# EasyEDA Pro project ProProject_zelda_guardian.epro, schematic main_sch

## Sheets
1 esp32s3: Create Date: 2023-06-17; Page Name: esp32s3; Project Name: zelda_guardian; Schematic Name: main_sch; Update Date: 2023-06-23; Company: 嘉立创EDA; Page Size: A4; Version: V1.0
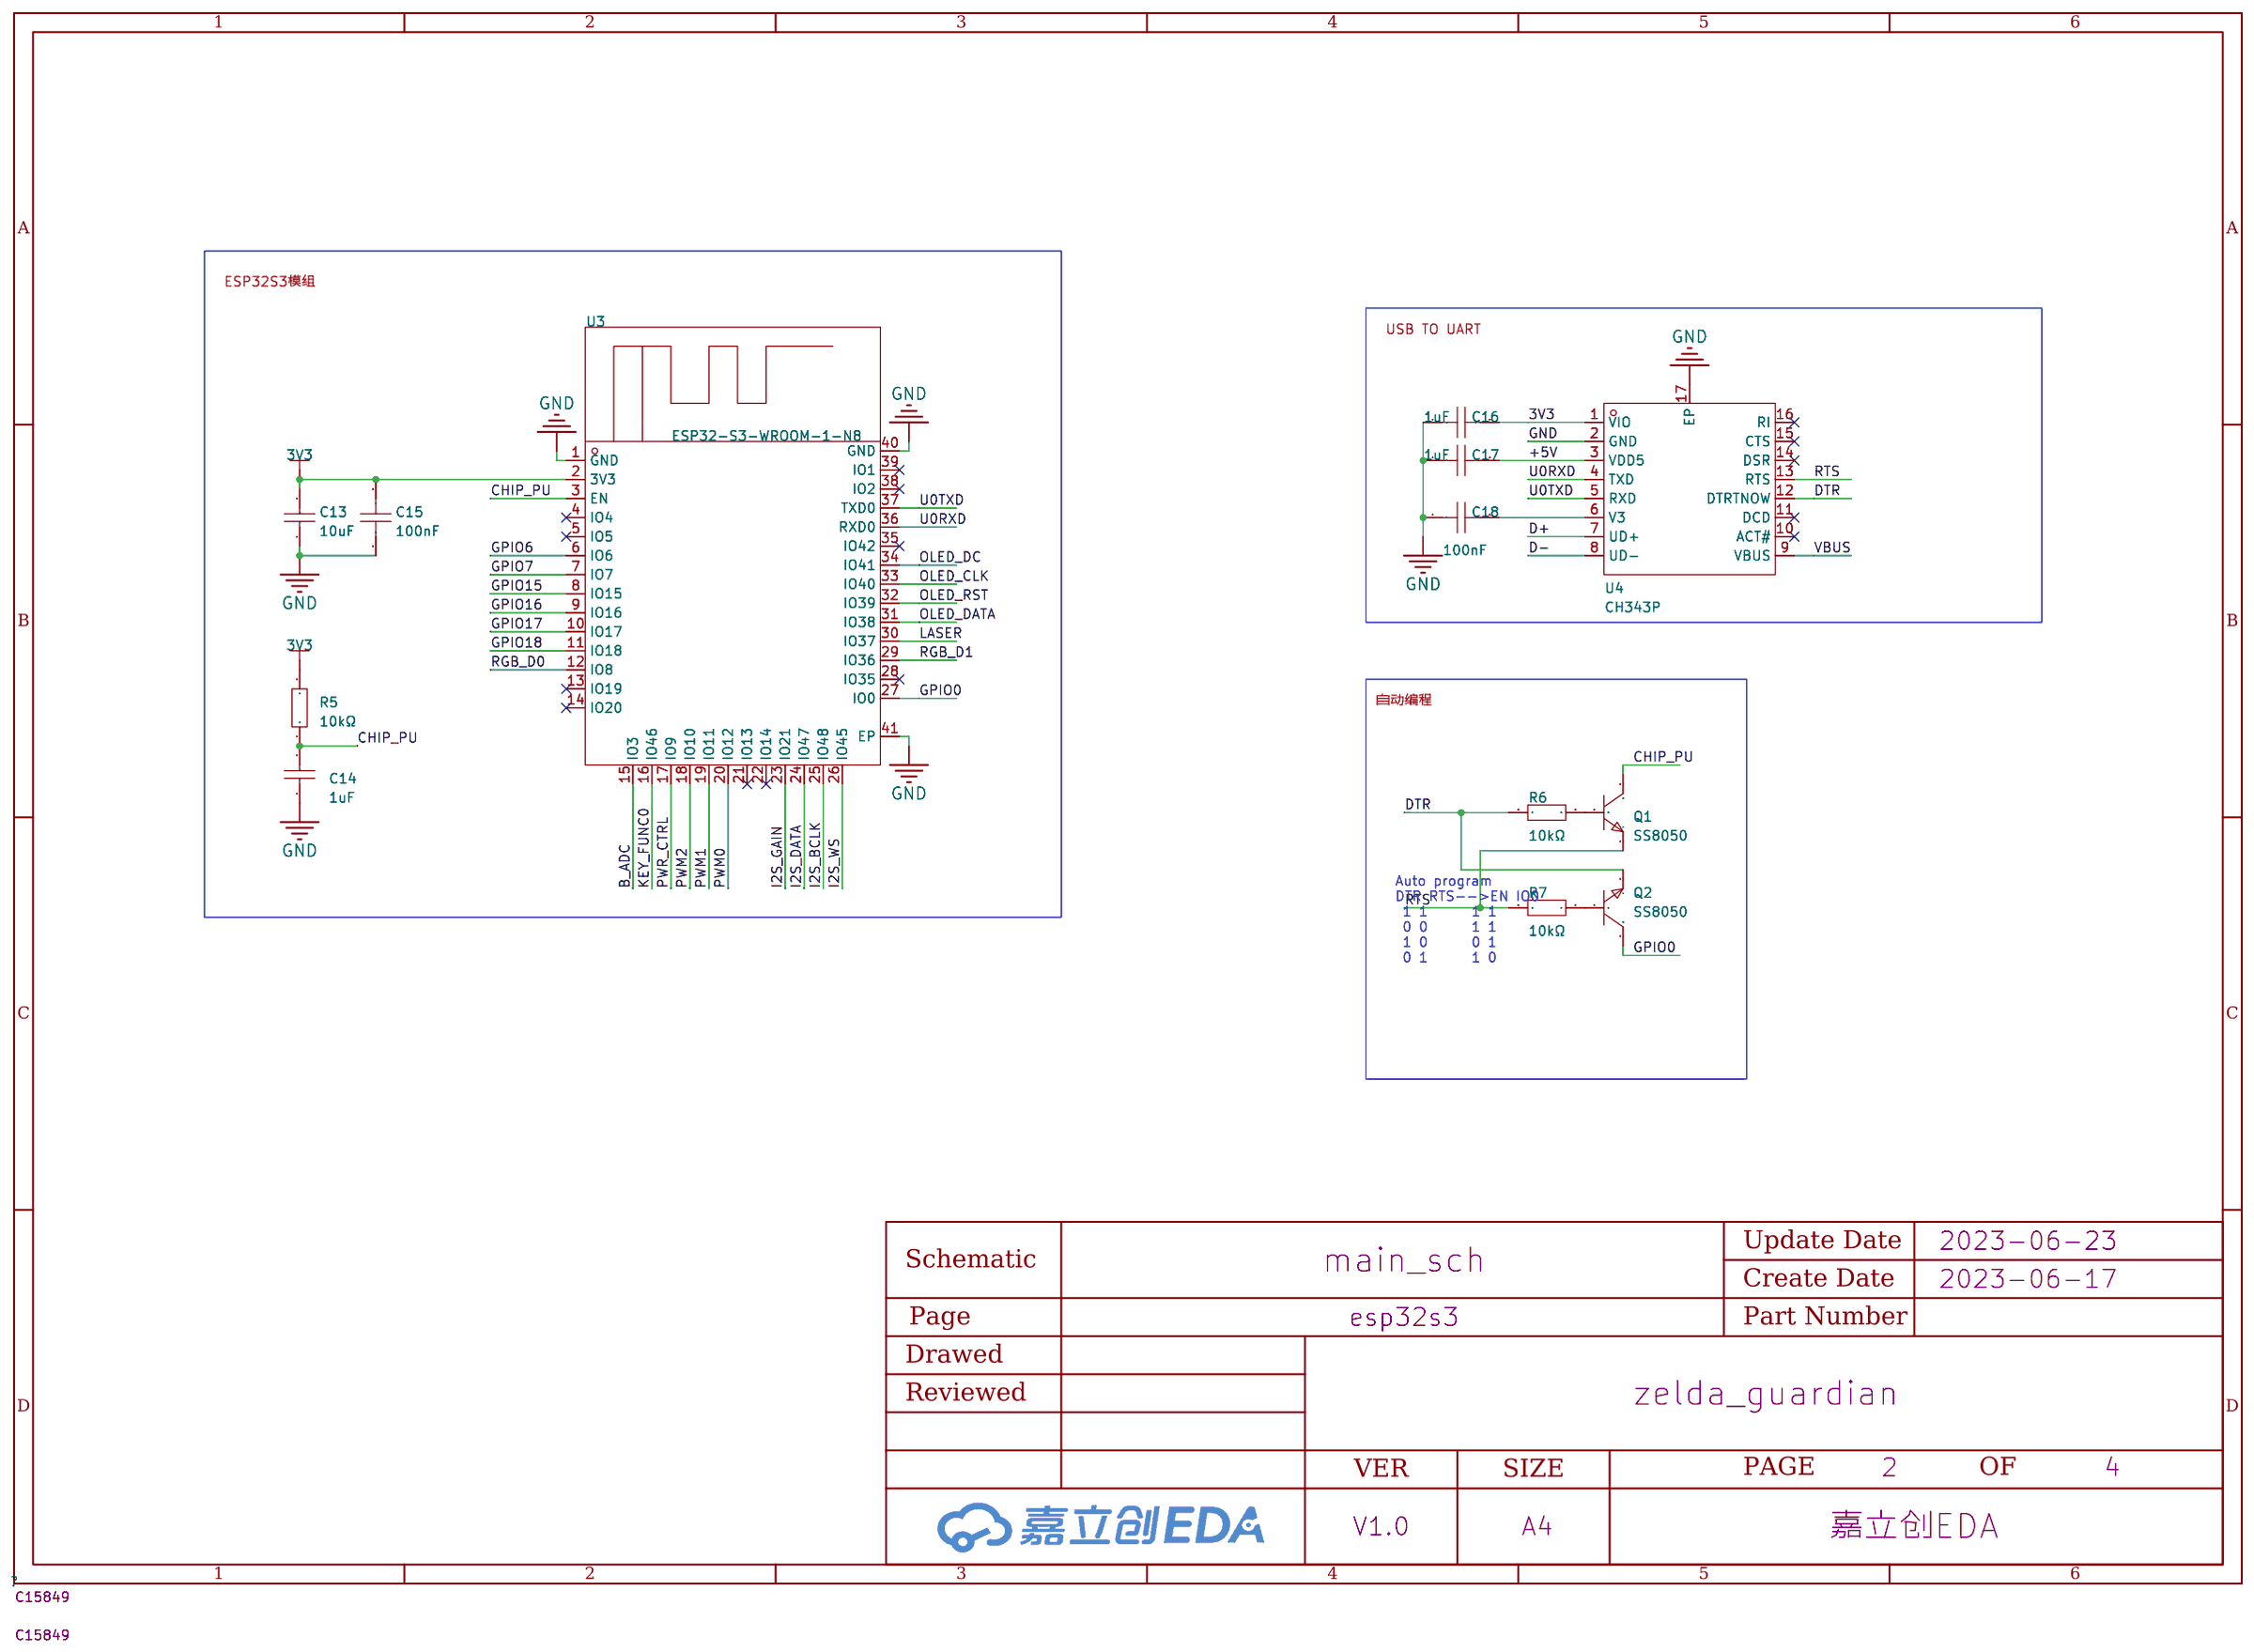
[diagram p0: esp32s3]
2 power: Page Name: power
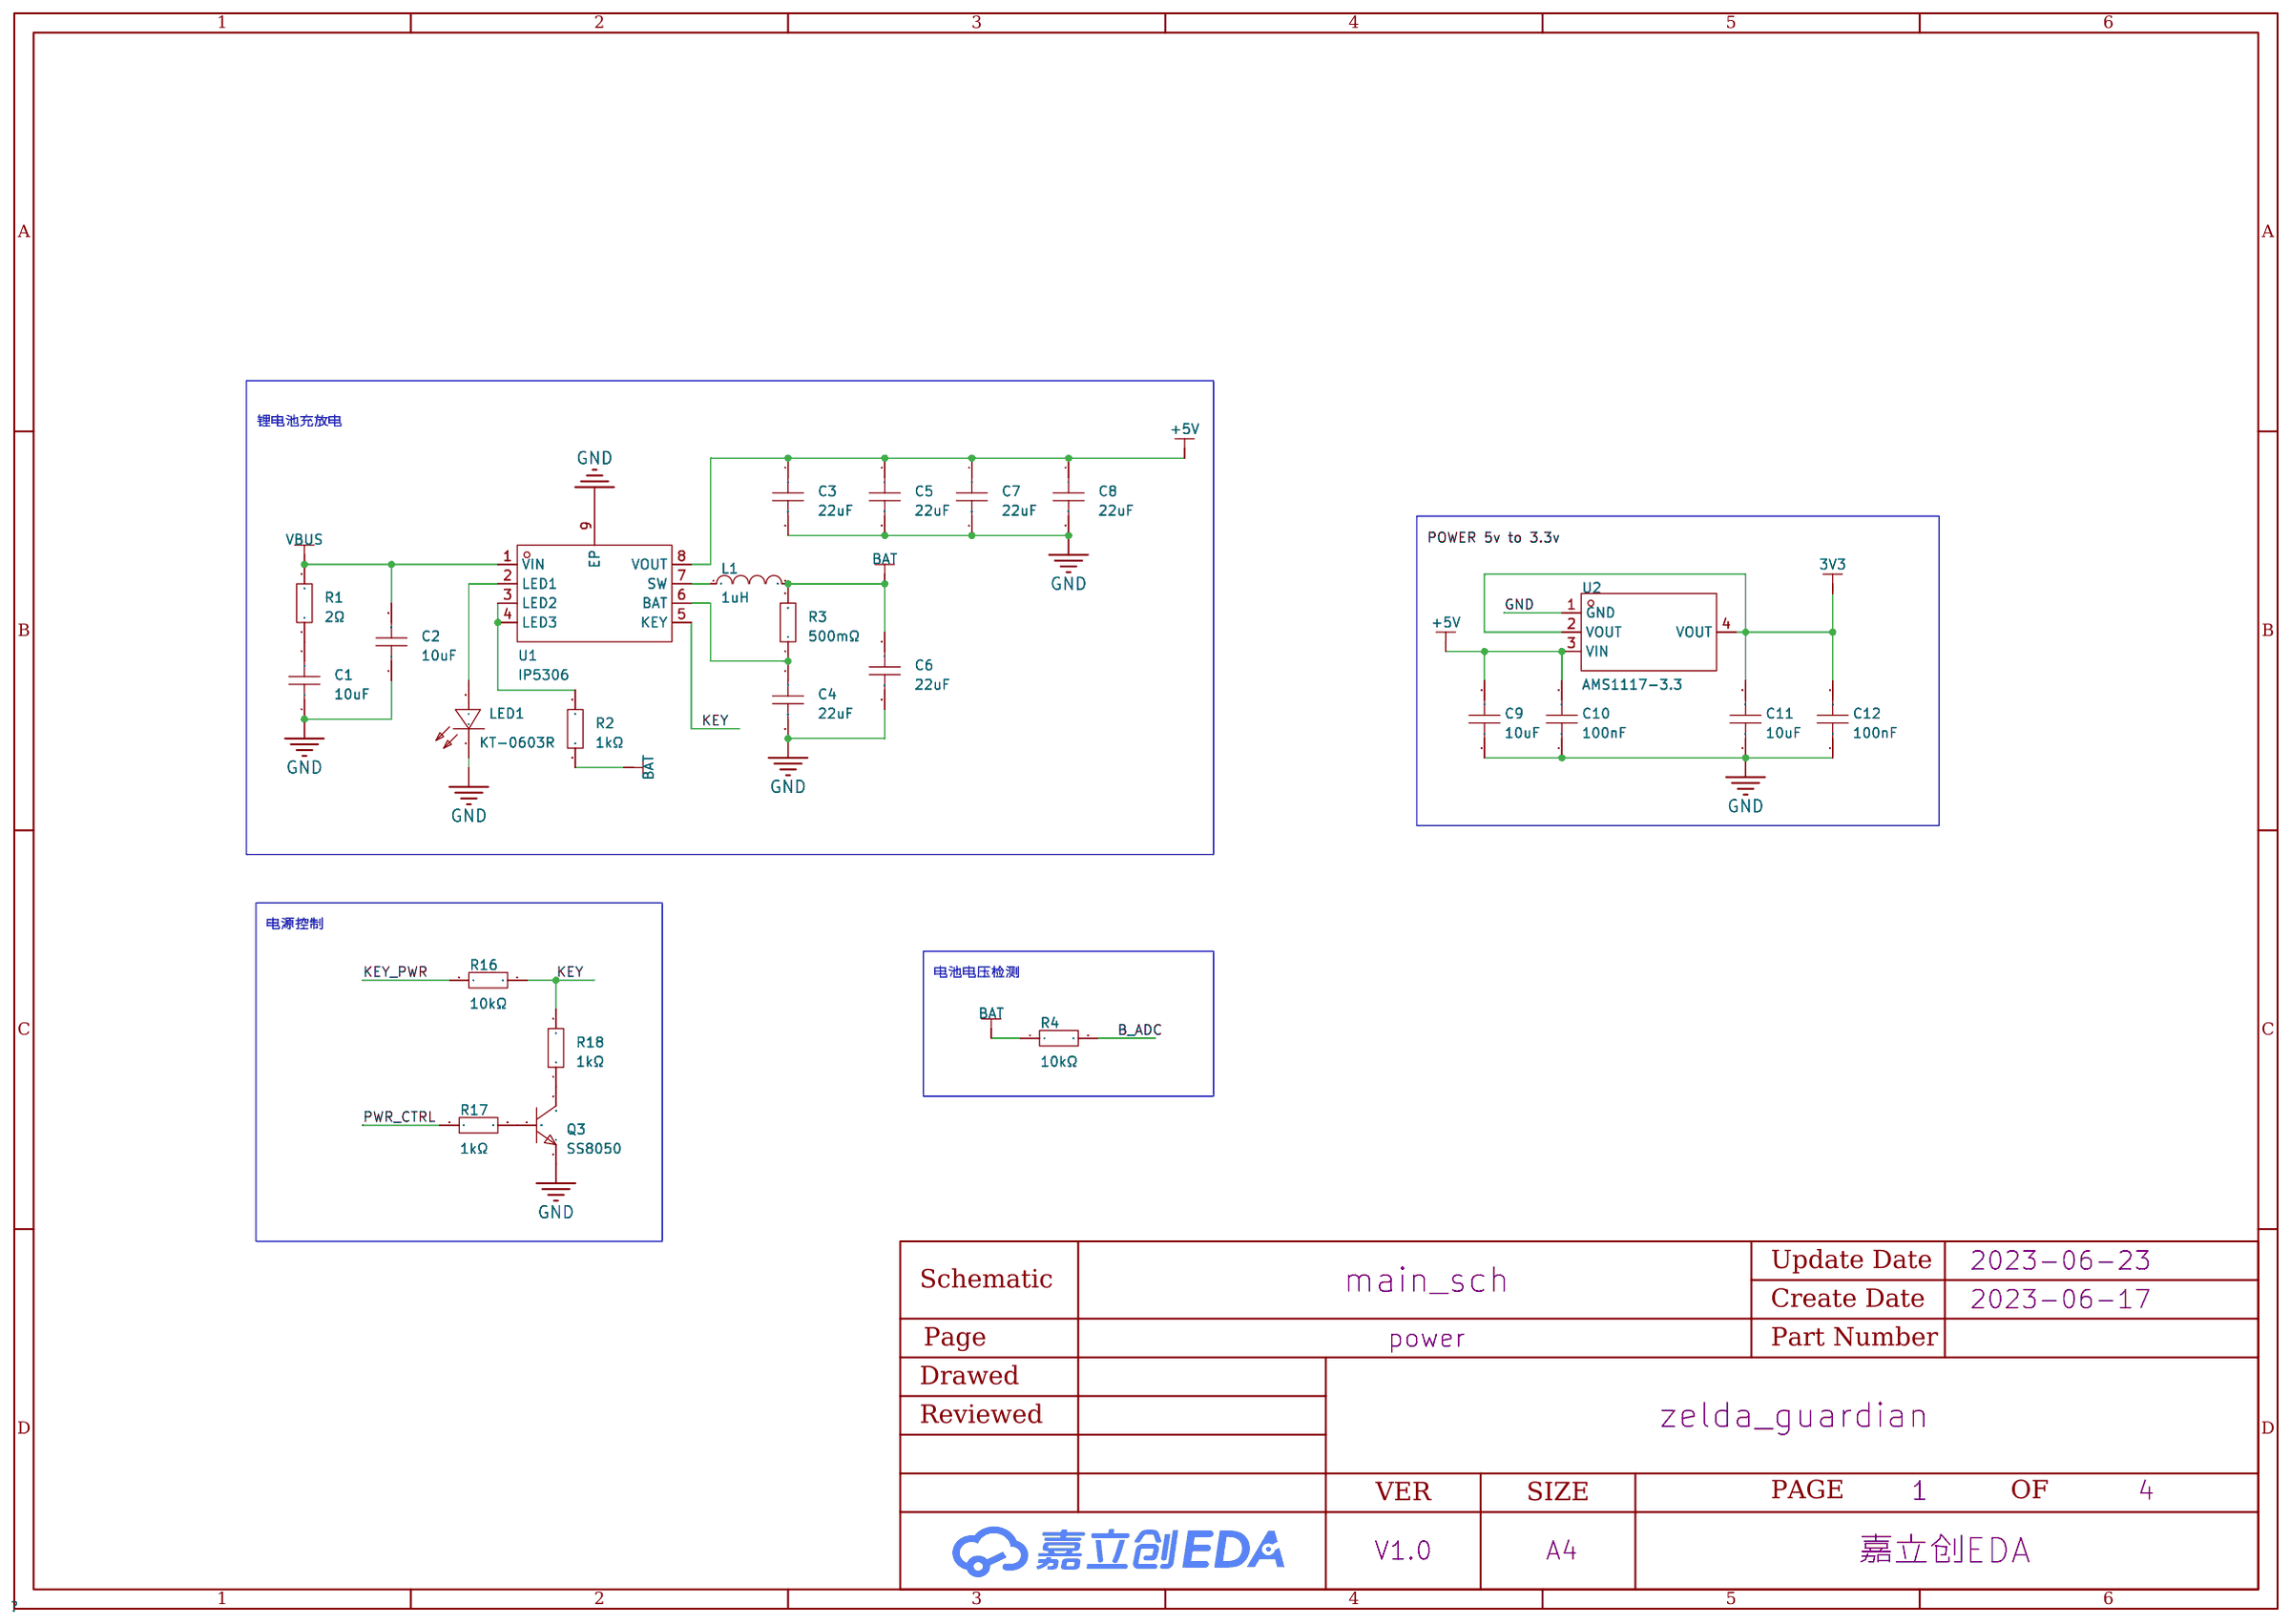
[diagram p1: power]
3 connector: Page Name: connector
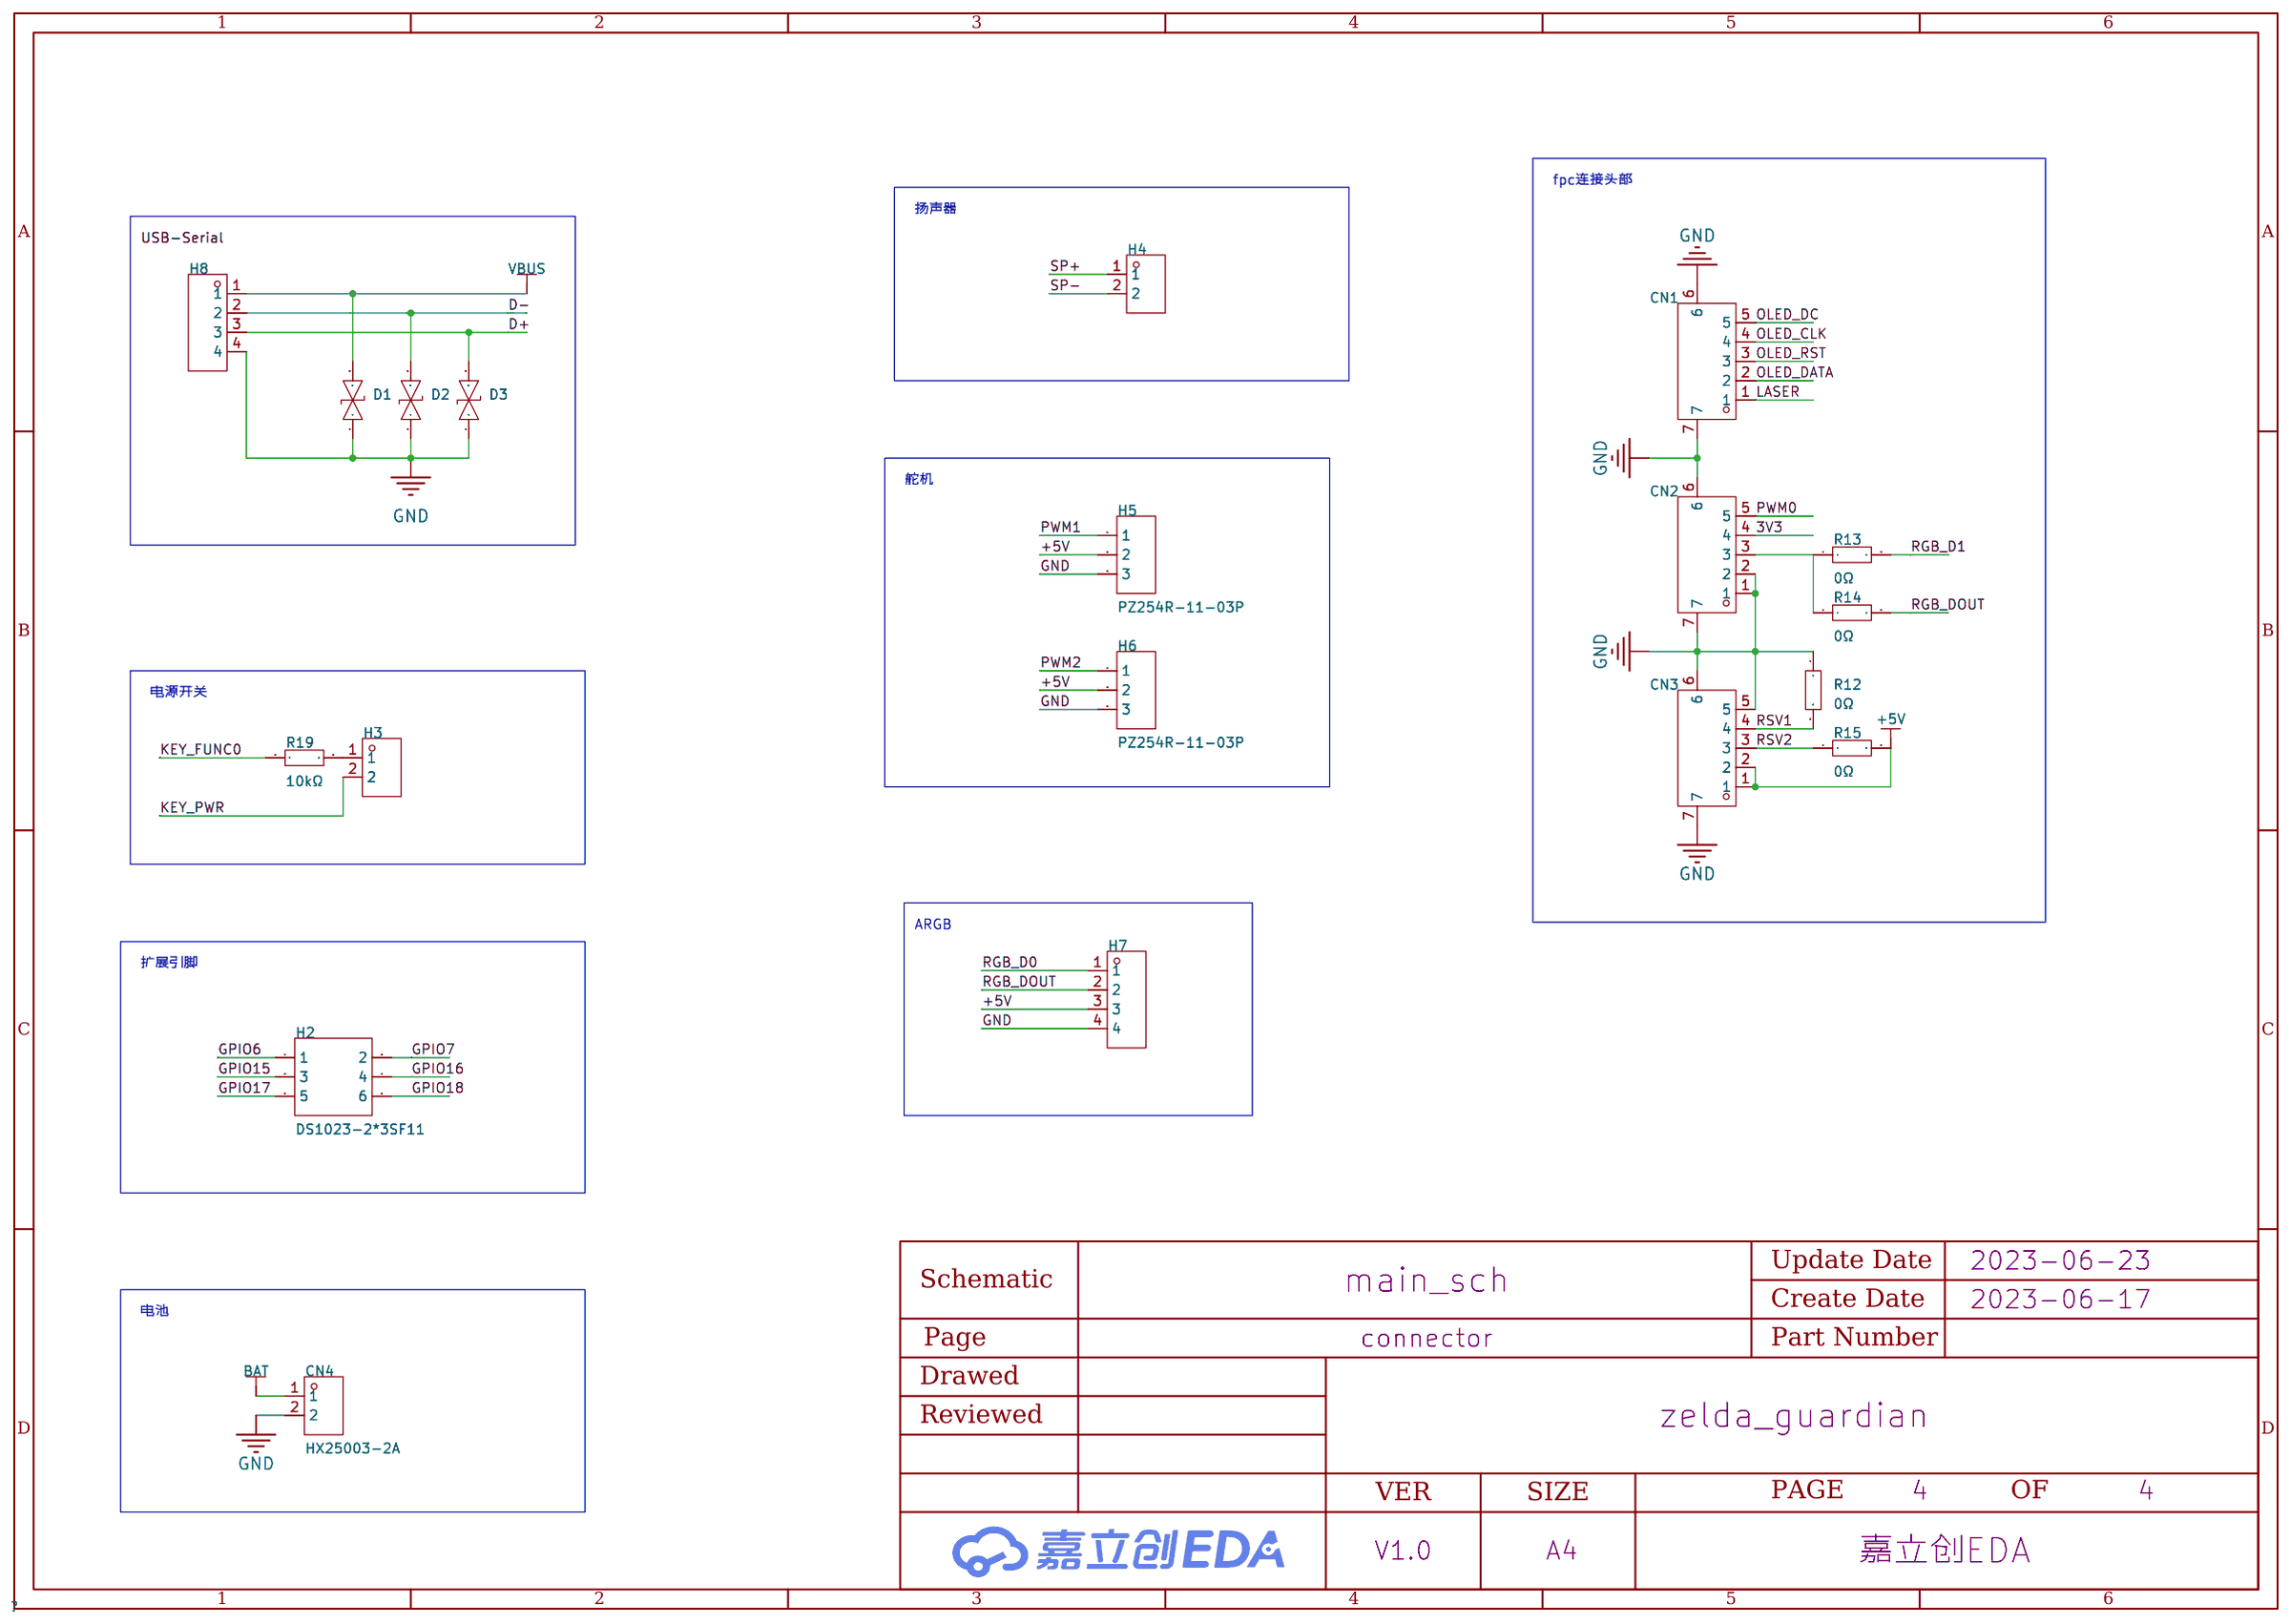
[diagram p2: connector]
4 amplifier: Page Name: amplifier
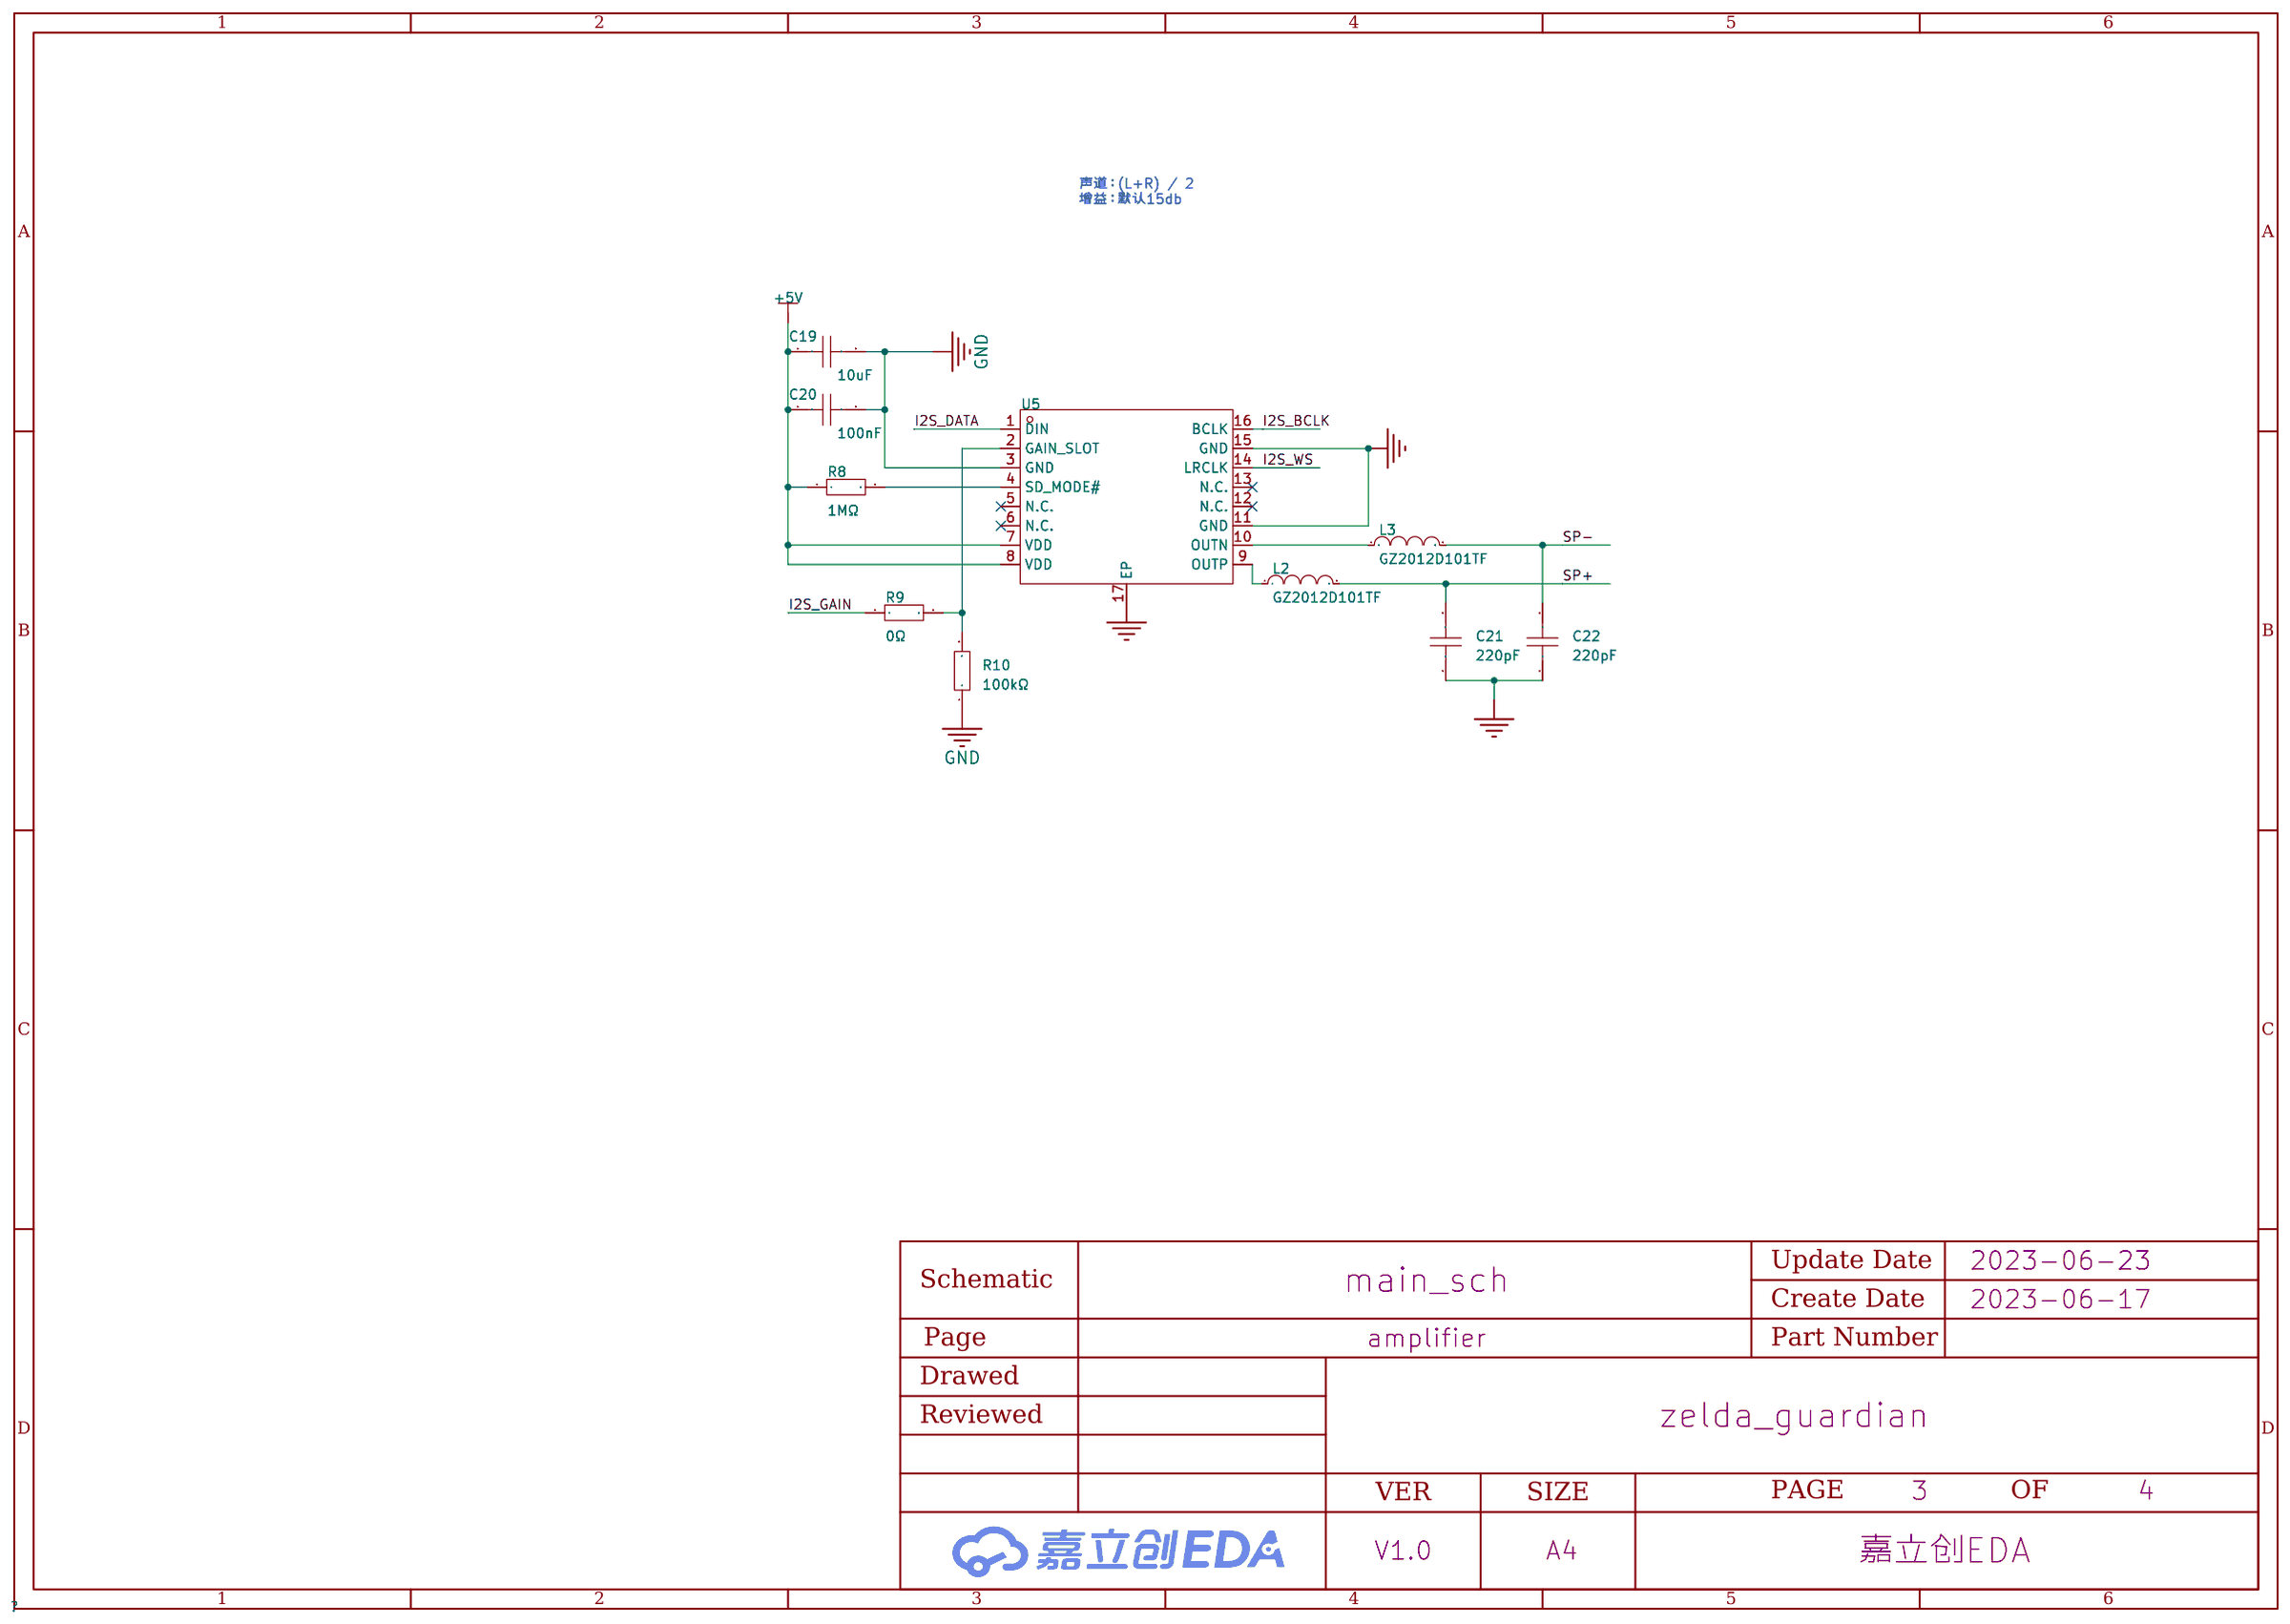
[diagram p3: amplifier]

## Parts
sheet amplifier
C19  10uF  [C0603]
C20  100nF  [C0603]
C21  220pF  [C0805]
C22  220pF  [C0805]
L2  GZ2012D101TF  [L0805]
L3  GZ2012D101TF  [L0805]
R8  1MΩ  [R0603]
R9  0Ω  [R0603]
R10  100kΩ  [R0603]
U5  MAX98357AETE+T  [TQFN-16_L3.0-W3.0-P0.50-BL-EP1.5]
sheet connector
CN1  0.5K-QX-5PWB  [FPC-SMD_5P-P0.50_HDGC_0.5K-QX-5PWB]
CN2  0.5K-QX-5PWB  [FPC-SMD_5P-P0.50_HDGC_0.5K-QX-5PWB]
CN3  0.5K-QX-5PWB  [FPC-SMD_5P-P0.50_HDGC_0.5K-QX-5PWB]
CN4  HX25003-2A  [CONN-TH_2P-P2.50_HX25003-2A]
D1  LESD5D5.0CT1G  [SOD-523_L1.2-W0.8-LS1.6-BI]
D2  LESD5D5.0CT1G  [SOD-523_L1.2-W0.8-LS1.6-BI]
D3  LESD5D5.0CT1G  [SOD-523_L1.2-W0.8-LS1.6-BI]
H2  DS1023-2*3SF11  [HDR-TH_6P-P2.54-V-F-R2-C3-S2.54]
H3  PZ254V-11-02P  [HDR-TH_2P-P2.54-V-M]
H4  PZ254V-11-02P  [HDR-TH_2P-P2.54-V-M]
H5  PZ254R-11-03P  [HDR-TH_3P-P2.54-H-M-W10.4]
H6  PZ254R-11-03P  [HDR-TH_3P-P2.54-H-M-W10.4]
H7  PZ254V-11-04P  [HDR-TH_4P-P2.54-V-M]
H8  PZ254V-11-04P  [HDR-TH_4P-P2.54-V-M]
R12  0Ω  [R0603]
R13  0Ω  [R0603]
R14  0Ω  [R0603]
R15  0Ω  [R0603]
R19  10kΩ  [R0603]
sheet esp32s3
C13  10uF  [C0603]
C14  1uF  [C0603]
C15  100nF  [C0603]
C16  1uF  [C0603]
C17  1uF  [C0603]
C18  100nF  [C0603]
Q1  SS8050  [SOT-23-3_L2.9-W1.3-P1.90-LS2.4-BR]
Q2  SS8050  [SOT-23-3_L2.9-W1.3-P1.90-LS2.4-BR]
R5  10kΩ  [R0603]
R6  10kΩ  [R0603]
R7  10kΩ  [R0603]
U3  ESP32-S3-WROOM-1-N8  [WIFIM-SMD_ESP32-S3-WROOM-1-N8]
U4  CH343P  [TQFN-16_L3.0-W3.0-P0.50-BL-EP1.7]
sheet power
C1  10uF  [C0603]
C2  10uF  [C0603]
C3  22uF  [C0603]
C4  22uF  [C0603]
C5  22uF  [C0603]
C6  22uF  [C0603]
C7  22uF  [C0603]
C8  22uF  [C0603]
C9  10uF  [C0603]
C10  100nF  [C0603]
C11  10uF  [C0603]
C12  100nF  [C0603]
L1  1uH  [IND-SMD_L4.4-W4.2]
LED1  KT-0603R  [LED0603-RD]
Q3  SS8050  [SOT-23-3_L2.9-W1.3-P1.90-LS2.4-BR]
R1  2Ω  [R0603]
R2  1kΩ  [R0603]
R3  500mΩ  [R0603]
R4  10kΩ  [R0603]
R16  10kΩ  [R0603]
R17  1kΩ  [R0603]
R18  1kΩ  [R0603]
U1  IP5306  [ESOP-8_L4.9-W3.9-P1.27-LS6.0-BL-EP]
U2  AMS1117-3.3  [SOT-223-3_L6.5-W3.4-P2.30-LS7.0-BR]

## Library data of the parts
C1 C2 C9 C11 C19 = CL10A106KP8NNNC: 容值:10uF;精度:±10%;额定电压:10V;材质(温度系数):X5R;; LCSC Part Name: 10uF ±10% 10V; Supplier Part: C19702; Manufacturer: SAMSUNG(三星); Supplier Footprint: 0603; JLCPCB Part Class: Basic Part; Datasheet: https://atta.szlcsc.com/upload/public/pdf/source/20160103/1457707703378.pdf; Supplier: LCSC; Tolerance: ±10%; Voltage Rated: 10V; Temperature Coefficient: X5R
C10 C12 C15 C18 C20 = CC0603KRX7R9BB104: 容值:100nF;精度:±10%;额定电压:50V;材质(温度系数):X7R;; LCSC Part Name: 100nF ±10% 50V; Supplier Part: C14663; Manufacturer: YAGEO(国巨); Supplier Footprint: 0603; JLCPCB Part Class: Basic Part; Datasheet: https://atta.szlcsc.com/upload/public/pdf/source/20180910/C282072_33301C7F631E79921B82A8DAC6BCC5B3.pdf; Supplier: LCSC; Tolerance: ±10%; Voltage Rated: 50V; Temperature Coefficient: X7R
C21 C22 = CC0805KRX7R9BB221: 容值:220pF;精度:±10%;额定电压:50V;材质(温度系数):X7R;; LCSC Part Name: 220pF ±10% 50V; Supplier Part: C107145; Manufacturer: YAGEO(国巨); Supplier Footprint: 0805; JLCPCB Part Class: Basic Part; Datasheet: https://atta.szlcsc.com/upload/public/pdf/source/20170420/1492670753114.pdf; Supplier: LCSC; Tolerance: ±10%; Voltage Rated: 50V; Temperature Coefficient: X7R
L2 L3 = GZ2012D101TF: 标称阻抗@测试频率:100Ω@100MHz;误差:±25%;直流电阻(RDC):-;; LCSC Part Name: 单路 0805磁珠 阻抗100Ω@100MHz; Supplier Part: C1015; Manufacturer: Sunlord(顺络); Supplier Footprint: 0805; JLCPCB Part Class: Basic Part; Datasheet: https://atta.szlcsc.com/upload/public/pdf/source/20211122/D62D2A98B0D2A28E1F860081C8C9E066.pdf; Supplier: LCSC; Impedance @ Frequency: 100Ω@100MHz; Tolerance: ±25%; Current Rating: 800mA; Circuits: 1
R8 = 0603WAF1004T5E: 电阻类型:厚膜电阻;阻值:1MΩ;精度:±1%;功率:100mW;; LCSC Part Name: 1MΩ ±1% 100mW; Supplier Part: C22935; Manufacturer: UNI-ROYAL(厚声); Supplier Footprint: 0603; JLCPCB Part Class: Basic Part; Datasheet: https://atta.szlcsc.com/upload/public/pdf/source/20200306/C422600_1E6D84923E4A46A82E41ADD87F860B5C.pdf; Supplier: LCSC; Type: 厚膜电阻; Tolerance: ±1%; Power(Watts): 100mW; Temperature Coefficient: ±100ppm/℃; Overload Voltage (Max): 75V; Operating Temperature Range: -55℃~+155℃
R9 R12-R15 = 0603WAF0000T5E: 电阻类型:厚膜电阻;阻值:0Ω;精度:±1%;功率:100mW;; LCSC Part Name: 0Ω ±1% 100mW; Supplier Part: C21189; Manufacturer: UNI-ROYAL(厚声); Supplier Footprint: 0603; JLCPCB Part Class: Basic Part; Datasheet: https://atta.szlcsc.com/upload/public/pdf/source/20200306/C422600_1E6D84923E4A46A82E41ADD87F860B5C.pdf; Supplier: LCSC; Type: 厚膜电阻; Tolerance: ±1%; Power(Watts): 100mW; Overload Voltage (Max): 75V; Operating Temperature Range: -55℃~+155℃
R10 = 0603WAF1003T5E: 电阻类型:厚膜电阻;阻值:100kΩ;精度:±1%;功率:100mW;; LCSC Part Name: 100kΩ ±1% 100mW; Supplier Part: C25803; Manufacturer: UNI-ROYAL(厚声); Supplier Footprint: 0603; JLCPCB Part Class: Basic Part; Datasheet: https://atta.szlcsc.com/upload/public/pdf/source/20200306/C422600_1E6D84923E4A46A82E41ADD87F860B5C.pdf; Supplier: LCSC; Type: 厚膜电阻; Tolerance: ±1%; Power(Watts): 100mW; Temperature Coefficient: ±100ppm/℃; Overload Voltage (Max): 75V; Operating Temperature Range: -55℃~+155℃
U5 = MAX98357AETE+T: 功放类型:-;输出功率:-;; Supplier Part: C910544; Manufacturer: ADI(亚德诺)/MAXIM(美信); Supplier Footprint: TQFN-16-EP(3x3); JLCPCB Part Class: Extended Part; Datasheet: https://atta.szlcsc.com/upload/public/pdf/source/20210106/C910544_CB6DE4B2CEE254A72E6BDB40E718D281.pdf; Supplier: LCSC
CN1-CN3 = 0.5K-QX-5PWB: 间距:0.5mm;触点数量:5;锁定特性:翻盖式;安装类型:卧贴;触点类型:下接;工作温度范围:-55℃~+85℃;; LCSC Part Name: 0.5mm P数:5 翻盖式 下接; Supplier Part: C2919476; Manufacturer: HDGC(华德共创); Supplier Footprint: SMD,P=0.5mm; JLCPCB Part Class: Extended Part; Datasheet: https://atta.szlcsc.com/upload/public/pdf/source/20211115/55A448787CA70A1AD4E6404A5BEFA17C.pdf; Supplier: LCSC; Pitch: 0.5mm; Number of Contacts: 5; Locking Feature: 翻盖式; Mounting Type: 卧贴; Contact Type: 下接; Height Above Board: 1mm; FFC, FCB Thickness: 0.3mm; Operating Temperature Range: -55℃~+85℃
CN4 = HX25003-2A: 参考系列:XH;间距:2.5mm;插针结构:1x2P;排数:1;每排PIN数:2;行距:-;公母:公型插针;安装方式:直插;额定电流:-;工作温度范围:-;; LCSC Part Name: XH 2.5mm 1x2P 直插 母座; Supplier Part: C442299; Manufacturer: HX(红星); Supplier Footprint: 插件,P=2.5mm; JLCPCB Part Class: Extended Part; Datasheet: https://atta.szlcsc.com/upload/public/pdf/source/20191028/C442299_791AF061D32404B3CF2743C2F942DF66.pdf; Supplier: LCSC; Reference Series: XH; Pitch: 2.5mm; Pins Structure: 1x2P; Number of Rows: 1; Number of PINs Per Row: 2; Gender: 公型插针; Mounting Style: 直插
D1-D3 = LESD5D5.0CT1G: 极性:双向;反向截止电压(Vrwm):5V;击穿电压(VBR):5.6V;钳位电压(Vc)@Ipp:18.6V;; LCSC Part Name: 双向ESD; Supplier Part: C383211; Manufacturer: LRC(乐山无线电); Supplier Footprint: SOD-523; JLCPCB Part Class: Extended Part; Datasheet: https://atta.szlcsc.com/upload/public/pdf/source/20190807/C383211_633DF4B4E2C161403226E5235FE33A1C.pdf; Supplier: LCSC; Polarity: 双向; Reverse Stand-Off Voltage (Vrwm): 5V; Breakdown Voltage (VBR): 5.6V; Peak Pulse Current(Ipp)@8/20us: 9.4A; Clamping Voltage@Ipp: 18.6V
H2 = DS1023-2*3SF11: 排数:双排;总孔位数:6;间距:2.54mm;插孔结构:2x3P;行距:2.54mm;安装类型:直插;塑高:-;触头材质:-;触头镀层:-;; LCSC Part Name: 2.54mm 2x3P; Supplier Part: C92272; Manufacturer: CONNFLY; Supplier Footprint: 插件,P=2.54mm; JLCPCB Part Class: Extended Part; Datasheet: https://atta.szlcsc.com/upload/public/pdf/source/20200424/C92272_A95D2DA05ACA87B9C9B122019351705D.pdf; Supplier: LCSC; Number of Rows: 双排; Number of Holes: 6; Pitch: 2.54mm; Holes Structure: 2x3P; Row Spacing: 2.54mm; Mounting Type: 直插
H3 H4 = 接线孔2p: 排数:单排;总PIN位数:2;间距:2.54mm;插针结构:1x2P;行距:-;安装类型:直插;圆针/方针:方针;额定电流:-;额定电压:-;配合针长度:6mm;塑高:2.5mm;端接针长度:3mm;触头材质:黄铜;触头镀层:-;工作温度范围:-40℃~+105℃;颜色:黑色;; LCSC Part Name: 2.54mm 1x2P 直插 方针; Supplier Part: C492401; Manufacturer: XFCN(兴飞); Supplier Footprint: 直插,P=2.54mm; JLCPCB Part Class: Extended Part; Datasheet: https://atta.szlcsc.com/upload/public/pdf/source/20200309/C492401_A812433581A9B211A7FFA413ADDFF0E5.pdf; Supplier: LCSC; Number of Rows: 单排; Number of Pins: 2; Pitch: 2.54mm; Pin Structure: 1x2P; Mounting Type: 直插; Circluar Pins/Square Pins: 方针; Length of Mating Pin: 6mm; Insulation Height: 2.5mm; Length of End Connection Pin: 3mm; Contact Material: 黄铜; Operating Temperature Range: -40℃~+105℃; Color: 黑色
H5 H6 = PZ254R-11-03P: 间距:2.54mm;总PIN位数:3;排数:1;插针结构:1x3P;行距:-;安装类型:弯插;圆针/方针:方针;额定电流:-;额定电压:-;配合针长度:6mm;塑高:2.5mm;触头材质:黄铜;触头镀层:-;工作温度范围:-40℃~+105℃;颜色:黑色;; LCSC Part Name: 2.54mm 1x3P 弯插 方针; Supplier Part: C492411; Manufacturer: XFCN(兴飞); Supplier Footprint: 插件,P=2.54mm; JLCPCB Part Class: Extended Part; Datasheet: https://atta.szlcsc.com/upload/public/pdf/source/20200309/C492411_5256E8AAA7569F6D33B6ADBFAE4F2888.pdf; Supplier: LCSC; Pitch: 2.54mm; Number of Pins: 3; Number of Rows: 1; Pin Structure: 1x3P; Mounting Type: 弯插; Circluar Pins/Square Pins: 方针; Length of Mating Pin: 6mm; Insulation Height: 2.5mm; Contact Material: 黄铜; Operating Temperature Range: -40℃~+105℃; Color: 黑色
H7 H8 = 接线孔4p: 排数:单排;总PIN位数:4;间距:2.54mm;插针结构:1x4P;行距:-;安装类型:直插;圆针/方针:方针;额定电流:3A;额定电压:250V;配合针长度:6mm;塑高:2.5mm;端接针长度:3mm;触头材质:-;工作温度范围:-40℃~+105℃;颜色:黑色;; LCSC Part Name: 2.54mm 1x4P 直插 方针; Supplier Part: C2691448; Manufacturer: XFCN(兴飞); Supplier Footprint: 直插,P=2.54mm; JLCPCB Part Class: Extended Part; Datasheet: https://atta.szlcsc.com/upload/public/pdf/source/20200309/C492403_F9F19131791D08044AD4F84F8E751A34.pdf; Supplier: LCSC; Number of Rows: 单排; Number of Pins: 4; Pitch: 2.54mm; Pin Structure: 1x4P; Mounting Type: 直插; Circluar Pins/Square Pins: 方针; Current Rating (Max): 3A; Voltage Rating (Max): 250V; Length of Mating Pin: 6mm; Insulation Height: 2.5mm; Length of End Connection Pin: 3mm; Operating Temperature Range: -40℃~+105℃; Color: 黑色
R4-R7 R16 R19 = 0603WAF1002T5E: 电阻类型:厚膜电阻;阻值:10kΩ;精度:±1%;功率:100mW;; LCSC Part Name: 厚膜电阻 10kΩ ±1% 100mW; Supplier Part: C25804; Manufacturer: UNI-ROYAL(厚声); Supplier Footprint: 0603; JLCPCB Part Class: Basic Part; Datasheet: https://atta.szlcsc.com/upload/public/pdf/source/20200306/C422600_1E6D84923E4A46A82E41ADD87F860B5C.pdf; Supplier: LCSC; Type: 厚膜电阻; Tolerance: ±1%; Power(Watts): 100mW; Temperature Coefficient: ±100ppm/℃; Overload Voltage (Max): 75V; Operating Temperature Range: -55℃~+155℃
C13 = CL10A106MA8NRNC: 容值:10uF;精度:±20%;额定电压:25V;材质(温度系数):X5R;; LCSC Part Name: 10uF ±20% 25V; Supplier Part: C96446; Manufacturer: SAMSUNG(三星); Supplier Footprint: 0603; JLCPCB Part Class: Basic Part; Datasheet: https://atta.szlcsc.com/upload/public/pdf/source/20170325/1490427913016.pdf; Supplier: LCSC; Tolerance: ±20%; Voltage Rated: 25V; Temperature Coefficient: X5R
C14 C16 C17 = CL10A105KB8NNNC: 容值:1uF;精度:±10%;额定电压:50V;材质(温度系数):X5R;; LCSC Part Name: 1uF ±10% 50V; Supplier Part: C15849; Manufacturer: SAMSUNG(三星); Supplier Footprint: 0603; JLCPCB Part Class: Basic Part; Datasheet: https://atta.szlcsc.com/upload/public/pdf/source/20160103/1457707679084.pdf; Supplier: LCSC; Tolerance: ±10%; Voltage Rated: 50V; Temperature Coefficient: X5R
Q1-Q3 = SS8050_C2150: 晶体管类型:NPN;集射极击穿电压(Vceo):25V;集电极电流(Ic):1.5A;功率(Pd):300mW;直流电流增益(hFE@Ic,Vce):200@100mA,1V;; LCSC Part Name: NPN 25V 1.5A Y1 200-350; Supplier Part: C2150; Manufacturer: CJ(江苏长电/长晶); Supplier Footprint: SOT-23; JLCPCB Part Class: Basic Part; Datasheet: https://atta.szlcsc.com/upload/public/pdf/source/20230322/AEE86F4B043774EFF80CAEA14A37D9E9.pdf; Supplier: LCSC; Transistor Type: NPN; Collector-Emitter Breakdown Voltage (Vceo): 25V; Collector Current (Ic): 1.5A; Power Dissipation (Pd): 300mW; Collector Cut-Off Current (Icbo): 100nA; Collector-Emitter Saturation Voltage (VCE(sat)@Ic,Ib): 500mV@800mA,80mA; DC Current Gain (hFE@Ic,Vce): 200@100mA,1V; Transition Frequency (fT): 100MHz; Operating Temperature: +150℃@(Tj)
U3 = ESP32-S3-WROOM-1-N8: Supplier Part: C2913198; Manufacturer: ESPRESSIF(乐鑫); Supplier Footprint: SMD,18x25.5mm; JLCPCB Part Class: Extended Part; Datasheet: https://atta.szlcsc.com/upload/public/pdf/source/20221026/9A44C6421221D672346AAE72DF9F8146.pdf; Supplier: LCSC
U4 = CH343P: 类型:-;协议类别:-;驱动器/接收器数:-;数据速率:-;; Supplier Part: C2846043; Manufacturer: WCH(南京沁恒); Supplier Footprint: QFN-16; JLCPCB Part Class: Extended Part; Datasheet: https://atta.szlcsc.com/upload/public/pdf/source/20211010/C2846043_7FA705E1F14A2906F6A2AFA45FA28209.pdf; Supplier: LCSC
C3-C8 = CL10A226MQ8NRNC: 容值:22uF;精度:±20%;额定电压:6.3V;材质(温度系数):X5R;; LCSC Part Name: 22uF ±20% 6.3V; Supplier Part: C59461; Manufacturer: SAMSUNG(三星); Supplier Footprint: 0603; JLCPCB Part Class: Basic Part; Datasheet: https://atta.szlcsc.com/upload/public/pdf/source/20160103/1457707740762.pdf; Supplier: LCSC; Tolerance: ±20%; Voltage Rated: 6.3V; Temperature Coefficient: X5R
L1 = MWSA0402S-1R0MT: 电感值:1uH;精度:±20%;额定电流:6A;直流电阻(DCR):27mΩ;; LCSC Part Name: 1uH ±20% 6A 27mΩ; Supplier Part: C408332; Manufacturer: Sunlord(顺络); Supplier Footprint: SMD; JLCPCB Part Class: Extended Part; Datasheet: https://atta.szlcsc.com/upload/public/pdf/source/20190729/C408332_3D52F124DB6180DB46F39AA99A169D86.pdf; Supplier: LCSC; Tolerance: ±20%; Rated Current: 6A; DC Resistance (DCR): 27mΩ
LED1 = KT-0603R: 发光颜色:红灯;二极管配置:-;主波长:-;色温:-;功率:-;安装方式:-;; LCSC Part Name: 红灯; Supplier Part: C2286; Manufacturer: KENTO; Supplier Footprint: 0603; JLCPCB Part Class: Basic Part; Datasheet: https://atta.szlcsc.com/upload/public/pdf/source/20160616/1466072038404.pdf; Supplier: LCSC; Emitted Color: 红灯; Operating Temperature: -40℃~+85℃
R1 = 0603WAF200KT5E: 电阻类型:厚膜电阻;阻值:2Ω;精度:±1%;功率:100mW;; LCSC Part Name: 2Ω ±1% 100mW; Supplier Part: C22977; Manufacturer: UNI-ROYAL(厚声); Supplier Footprint: 0603; JLCPCB Part Class: Basic Part; Datasheet: https://atta.szlcsc.com/upload/public/pdf/source/20200306/C422600_1E6D84923E4A46A82E41ADD87F860B5C.pdf; Supplier: LCSC; Type: 厚膜电阻; Tolerance: ±1%; Power(Watts): 100mW; Temperature Coefficient: ±400ppm/℃; Overload Voltage (Max): 75V; Operating Temperature Range: -55℃~+155℃
R2 R17 R18 = 0603WAF1001T5E: 电阻类型:厚膜电阻;阻值:1kΩ;精度:±1%;功率:100mW;; LCSC Part Name: 1kΩ ±1% 100mW; Supplier Part: C21190; Manufacturer: UNI-ROYAL(厚声); Supplier Footprint: 0603; JLCPCB Part Class: Basic Part; Datasheet: https://atta.szlcsc.com/upload/public/pdf/source/20200306/C422600_1E6D84923E4A46A82E41ADD87F860B5C.pdf; Supplier: LCSC; Type: 厚膜电阻; Tolerance: ±1%; Power(Watts): 100mW; Temperature Coefficient: ±100ppm/℃; Overload Voltage (Max): 75V; Operating Temperature Range: -55℃~+155℃
R3 = HP03W5F500LT5E: 阻值:500mΩ;精度:±1%;功率:200mW;; LCSC Part Name: 500mΩ ±1% 200mW; Supplier Part: C414986; Manufacturer: UNI-ROYAL(厚声); Supplier Footprint: 0603; JLCPCB Part Class: Extended Part; Datasheet: https://atta.szlcsc.com/upload/public/pdf/source/20191008/C414986_453A7519755581D02A44E5E26F2CD2BD.pdf; Supplier: LCSC; Tolerance: ±1%; Power(Watts): 200mW; Temperature Coefficient: ±100ppm/℃; Overload Voltage (Max): 75V; Operating Temperature Range: -55℃~+155℃
U1 = IP5306: 2.1A充电2.4A放电高集成度移动电源SOC; Supplier Part: C181692; Manufacturer: INJOINIC(英集芯); Supplier Footprint: ESOP-8; JLCPCB Part Class: Extended Part; Datasheet: https://atta.szlcsc.com/upload/public/pdf/source/20180920/C181692_842C9BF636DF123BB66E91FC1AD6F13F.pdf; Supplier: LCSC
U2 = AMS1117-3.3_C6186: 输出类型:固定;输出极性:正;最大输入电压:-;输出电压:3.3V;输出电流:1A;电源纹波抑制比(PSRR):72dB@(120Hz);; LCSC Part Name: 输出3.3V 1A; Supplier Part: C6186; Manufacturer: AMS; Supplier Footprint: SOT-223; JLCPCB Part Class: Basic Part; Datasheet: https://atta.szlcsc.com/upload/public/pdf/source/20180727/C6186_7A095716F0823C02F1997A905E26C086.pdf; Supplier: LCSC; Output Type: 固定; Output Polarity: 正; Number of Outputs: 1; Output Voltage: 3.3V; Dropout Voltage: 1.3V@(800mA); Output Current: 1A; Power Supply Rejection Ratio (PSRR): 72dB@(120Hz)

## Nets
3V3: C11.2 C12.2 C13.2 C15.2 C16.2 CN2.4 R5.2 U2.2(VOUT) U2.4(VOUT) U3.2(3V3) U4.1(VIO)
+5V: C3.1 C5.1 C7.1 C8.1 C9.2 C10.2 C17.2 C19.1 C20.1 CN3.1 CN3.2 H5.2 H6.2 H7.3 R8.1 R15.2 U1.8(VOUT) U2.3(VIN) U4.3(VDD5) U5.7(VDD) U5.8(VDD)
GND: C1.1 C2.1 C3.2 C4.2 C5.2 C6.2 C7.2 C8.2 C9.1 C10.1 C11.1 C12.1 C13.1 C14.1 C15.1 C16.1 C17.1 C18.1 C19.2 C20.2 C21.1 C22.1 CN1.6 CN1.7 CN2.1 CN2.2 CN2.6 CN2.7 CN3.5 CN3.6 CN3.7 CN4.2 D1.1 D2.1 D3.1 H5.3 H6.3 H7.4 H8.4 LED1.1(K) Q3.2(E) R10.1 R12.1 U1.9(EP) U2.1(GND) U3.1(GND) U3.40(GND) U3.41(EP) U4.2(GND) U4.17(EP) U5.3(GND) U5.11(GND) U5.15(GND) U5.17(EP)
VBUS: C2.2 D1.2 H8.1 R1.2 U1.1(VIN) U4.9(VBUS)
B_ADC: R4.2 U3.15(IO3)
BAT: C6.1 CN4.1 L1.2 R2.1 R3.2 R4.1
CHIP_PU: C14.2 Q1.3(C) R5.1 U3.3(EN)
D+: D3.2 H8.3 U4.7(UD+)
D-: D2.2 H8.2 U4.8(UD-)
DTR: Q2.2(E) R6.2 U4.12(DTRTNOW)
GPIO0: Q2.3(C) U3.27(IO0)
GPIO6: H2.1 U3.6(IO6)
GPIO7: H2.2 U3.7(IO7)
GPIO15: H2.3 U3.8(IO15)
GPIO16: H2.4 U3.9(IO16)
GPIO17: H2.5 U3.10(IO17)
GPIO18: H2.6 U3.11(IO18)
I2S_BCLK: U3.25(IO48) U5.16(BCLK)
I2S_DATA: U3.24(IO47) U5.1(DIN)
I2S_GAIN: R9.1 U3.23(IO21)
I2S_WS: U3.26(IO45) U5.14(LRCLK)
KEY: R16.1 R18.2 U1.5(KEY)
KEY_FUNC0: R19.1 U3.16(IO46)
KEY_PWR: H3.2 R16.2
LASER: CN1.1 U3.30(IO37)
OLED_CLK: CN1.4 U3.33(IO40)
OLED_DATA: CN1.2 U3.31(IO38)
OLED_DC: CN1.5 U3.34(IO41)
OLED_RST: CN1.3 U3.32(IO39)
PWM0: CN2.5 U3.20(IO12)
PWM1: H5.1 U3.19(IO11)
PWM2: H6.1 U3.18(IO10)
PWR_CTRL: R17.1 U3.17(IO9)
RGB_D0: H7.1 U3.12(IO8)
RGB_D1: R13.2 U3.29(IO36)
RGB_DOUT: H7.2 R14.2
RSV1: CN3.4 R12.2
RSV2: CN3.3 R15.1
RTS: Q1.2(E) R7.2 U4.13(RTS)
SP+: C21.2 H4.1 L2.2
SP-: C22.2 H4.2 L3.2
U0RXD: U3.36(RXD0) U4.4(TXD)
U0TXD: U3.37(TXD0) U4.5(RXD)
$1N5557: C18.2 U4.6(V3)
$1N5576: Q1.1(B) R6.1
$1N5577: Q2.1(B) R7.1
$2N1116: C1.2 R1.1
$2N1258: L1.1 U1.7(SW)
$2N1709: C4.1 R3.1 U1.6(BAT)
$2N2001: LED1.2(A) U1.2(LED1)
$2N2011: R2.2 U1.3(LED2) U1.4(LED3)
$2N4252: Q3.3(C) R18.1
$2N4254: Q3.1(B) R17.2
$3N1741: CN2.3 R13.1 R14.1
$3N8051: H3.1 R19.2
$4N470: R8.2 U5.4(SD_MODE#)
$4N475: L2.1 U5.9(OUTP)
$4N476: L3.1 U5.10(OUTN)
$4N494: R9.2 R10.2 U5.2(GAIN_SLOT)

Not connected (* = marked no-connect by the designer): U3 4(IO4)* 5(IO5)* 13(IO19)* 14(IO20)* 21(IO13)* 22(IO14)* 28(IO35)* 35(IO42)* 38(IO2)* 39(IO1)*; U4 10(ACT#)* 11(DCD)* 14(DSR)* 15(CTS)* 16(RI)*; U5 5(N.C.)* 6(N.C.)* 12(N.C.)* 13(N.C.)*

## Notes on the sheets
sheet 1
- ESP32S3模组
- USB TO UART
- 自动编程
- Auto program
  DTR RTS-->EN IO0
   1 1      1 1
   0 0      1 1
   1 0      0 1
   0 1      1 0
sheet 2
- 锂电池充放电
- POWER 5v to 3.3v
- 电源控制
- 电池电压检测
sheet 3
- fpc连接头部
- 扬声器
- USB-Serial
- 舵机
- 电源开关
- ARGB
- 扩展引脚
- 电池
sheet 4
- 声道：(L+R) / 2
  增益：默认15db
